# Altium schematic sheet FPGA3.SchDoc: Animated Archer Main PCB
size Letter; Author: John Eric Martin; Engineer: John Eric Martin; Organization: UCCS IEEE Robotics; Address1: 1420 Austin Bluffs Pkwy; Address2: Colorado Springs, CO 80918; DocumentNumber: FPGA3; Revision: 1; SheetNumber: 5; SheetTotal: 10; ProjectName: Animated Archer Quadcopter
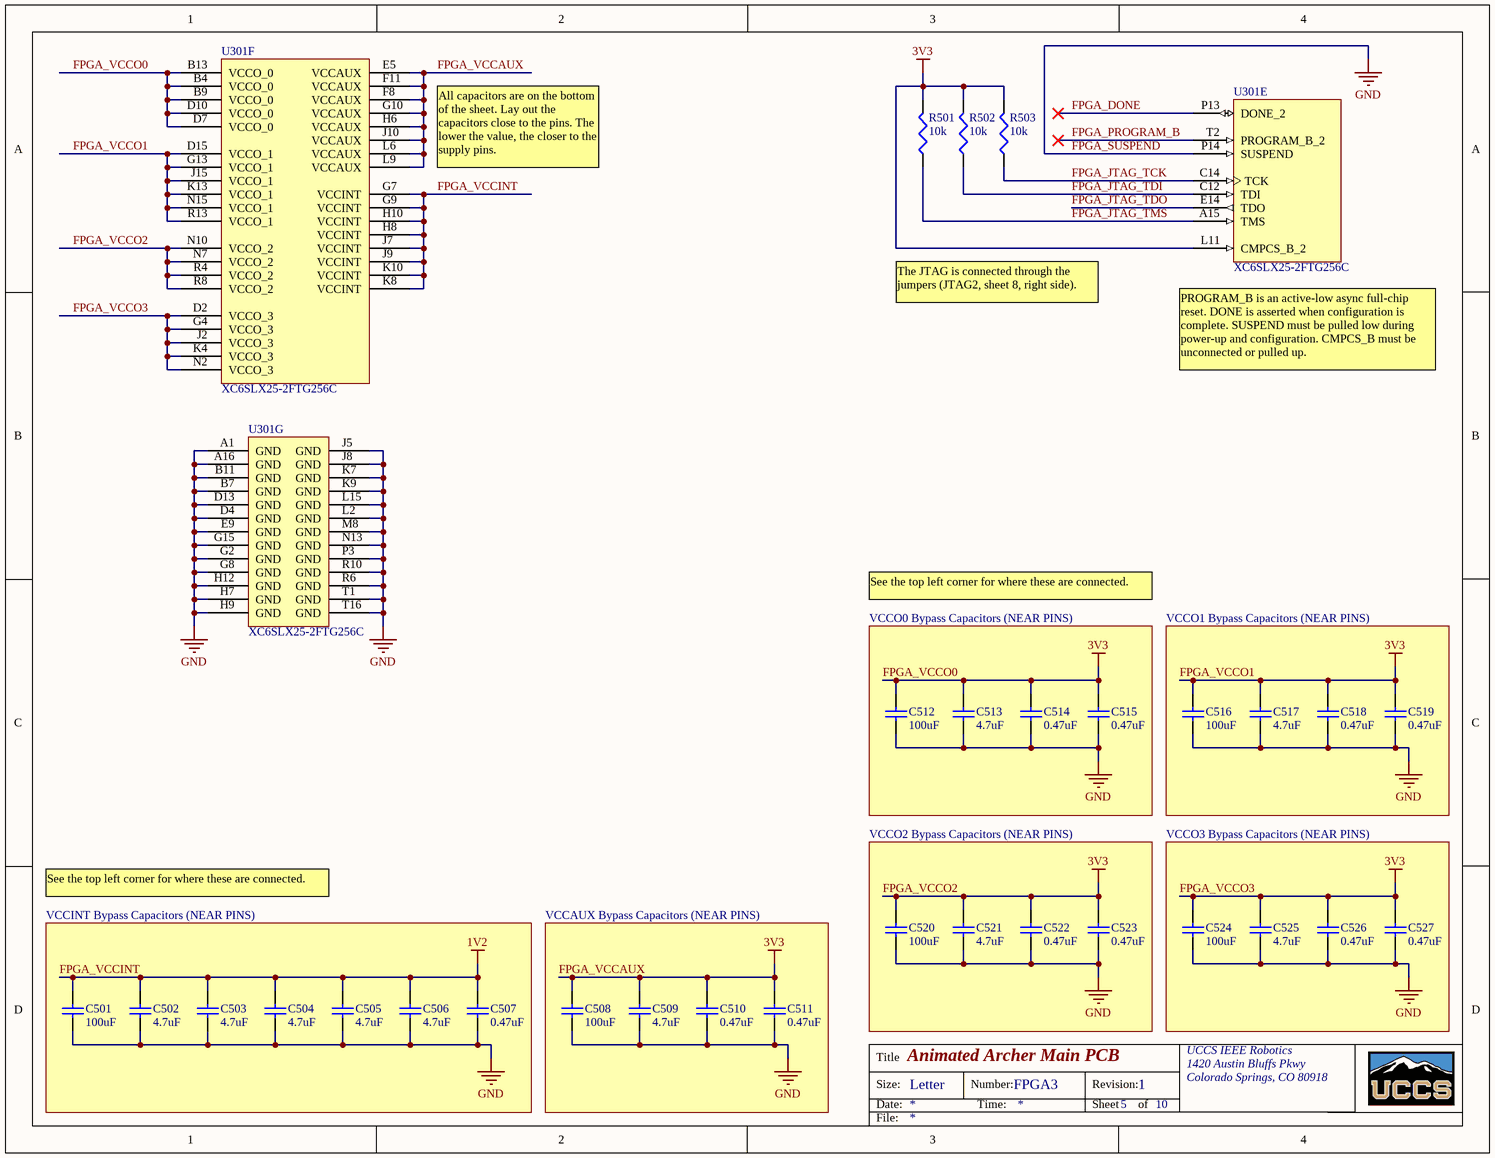
[diagram p0: FPGA3.SchDoc]

## Parts
C501  value 100uF  [1608[0603]]  (hidden comment: 0.1uF)
C502  value 4.7uF  [1608[0603]]  (hidden comment: 0.1uF)
C503  value 4.7uF  [1608[0603]]  (hidden comment: 0.1uF)
C504  value 4.7uF  [1608[0603]]  (hidden comment: 0.1uF)
C505  value 4.7uF  [1608[0603]]  (hidden comment: 0.1uF)
C506  value 4.7uF  [1608[0603]]  (hidden comment: 0.1uF)
C507  value 0.47uF  [1608[0603]]  (hidden comment: 0.1uF)
C508  value 100uF  [1608[0603]]  (hidden comment: 0.1uF)
C509  value 4.7uF  [1608[0603]]  (hidden comment: 0.1uF)
C510  value 0.47uF  [1608[0603]]  (hidden comment: 0.1uF)
C511  value 0.47uF  [1608[0603]]  (hidden comment: 0.1uF)
C512  value 100uF  [1608[0603]]  (hidden comment: 0.1uF)
C513  value 4.7uF  [1608[0603]]  (hidden comment: 0.1uF)
C514  value 0.47uF  [1608[0603]]  (hidden comment: 0.1uF)
C515  value 0.47uF  [1608[0603]]  (hidden comment: 0.1uF)
C516  value 100uF  [1608[0603]]  (hidden comment: 0.1uF)
C517  value 4.7uF  [1608[0603]]  (hidden comment: 0.1uF)
C518  value 0.47uF  [1608[0603]]  (hidden comment: 0.1uF)
C519  value 0.47uF  [1608[0603]]  (hidden comment: 0.1uF)
C520  value 100uF  [1608[0603]]  (hidden comment: 0.1uF)
C521  value 4.7uF  [1608[0603]]  (hidden comment: 0.1uF)
C522  value 0.47uF  [1608[0603]]  (hidden comment: 0.1uF)
C523  value 0.47uF  [1608[0603]]  (hidden comment: 0.1uF)
C524  value 100uF  [1608[0603]]  (hidden comment: 0.1uF)
C525  value 4.7uF  [1608[0603]]  (hidden comment: 0.1uF)
C526  value 0.47uF  [1608[0603]]  (hidden comment: 0.1uF)
C527  value 0.47uF  [1608[0603]]  (hidden comment: 0.1uF)
R501  value 10k  [J1-0603]  (hidden comment: Res3)
R502  value 10k  [J1-0603]  (hidden comment: Res3)
R503  value 10k  [J1-0603]  (hidden comment: Res3)
U301  XC6SLX25-2FTG256C  [FTG256]  (parts E,F,G of 7)

## Blocks framed on the sheet
VCCO0 Bypass Capacitors (NEAR PINS): C512-C515
VCCO1 Bypass Capacitors (NEAR PINS): C516-C519
VCCO2 Bypass Capacitors (NEAR PINS): C520-C523
VCCO3 Bypass Capacitors (NEAR PINS): C524-C527
VCCINT Bypass Capacitors (NEAR PINS): C501-C507
VCCAUX Bypass Capacitors (NEAR PINS): C508-C511

## Nets
FPGA_SUSPEND: C501.1 C502.1 C503.1 C504.1 C505.1 C506.1 C507.1 C508.1 C509.1 C510.1 C511.1 C512.1 C513.1 C514.1 C515.1 C516.1 C517.1 C518.1 C519.1 C520.1 C521.1 C522.1 C523.1 C524.1 C525.1 C526.1 C527.1 U301.A1(GND) U301.A16(GND) U301.B7(GND) U301.B11(GND) U301.D4(GND) U301.D13(GND) U301.E9(GND) U301.G2(GND) U301.G8(GND) U301.G15(GND) U301.H7(GND) U301.H9(GND) U301.H12(GND) U301.J5(GND) U301.J8(GND) U301.K7(GND) U301.K9(GND) U301.L2(GND) U301.L15(GND) U301.M8(GND) U301.N13(GND) U301.P3(GND) U301.P14(SUSPEND) U301.R6(GND) U301.R10(GND) U301.T1(GND) U301.T16(GND)  [also labelled GND]
FPGA_VCCAUX: C508.2 C509.2 C510.2 C511.2 C512.2 C513.2 C514.2 C515.2 C516.2 C517.2 C518.2 C519.2 C520.2 C521.2 C522.2 C523.2 C524.2 C525.2 C526.2 C527.2 R501.2 R502.2 R503.2 U301.B4(VCCO_0) U301.B9(VCCO_0) U301.B13(VCCO_0) U301.D2(VCCO_3) U301.D7(VCCO_0) U301.D10(VCCO_0) U301.D15(VCCO_1) U301.E5(VCCAUX) U301.F8(VCCAUX) U301.F11(VCCAUX) U301.G4(VCCO_3) U301.G10(VCCAUX) U301.G13(VCCO_1) U301.H6(VCCAUX) U301.J2(VCCO_3) U301.J10(VCCAUX) U301.J15(VCCO_1) U301.K4(VCCO_3) U301.K13(VCCO_1) U301.L6(VCCAUX) U301.L9(VCCAUX) U301.L11(CMPCS_B_2) U301.N2(VCCO_3) U301.N7(VCCO_2) U301.N10(VCCO_2) U301.N15(VCCO_1) U301.R4(VCCO_2) U301.R8(VCCO_2) U301.R13(VCCO_1)  [also labelled 3V3, FPGA_VCCO0, FPGA_VCCO1, FPGA_VCCO2, FPGA_VCCO3]
FPGA_VCCINT: C501.2 C502.2 C503.2 C504.2 C505.2 C506.2 C507.2 U301.G7(VCCINT) U301.G9(VCCINT) U301.H8(VCCINT) U301.H10(VCCINT) U301.J7(VCCINT) U301.J9(VCCINT) U301.K8(VCCINT) U301.K10(VCCINT)  [also labelled 1V2]
FPGA_DONE: U301.P13(DONE_2)
FPGA_JTAG_TCK: R503.1 U301.C14(TCK)
FPGA_JTAG_TDI: R502.1 U301.C12(TDI)
FPGA_JTAG_TDO: U301.E14(TDO)
FPGA_JTAG_TMS: R501.1 U301.A15(TMS)
FPGA_PROGRAM_B: U301.T2(PROGRAM_B_2)

## Notes on the sheet
- All capacitors are on the bottom of the sheet. Lay out the capacitors close to the pins. The lower the value, the closer to the supply pins.
- The JTAG is connected through the jumpers (JTAG2, sheet 8, right side).
- (near U301) PROGRAM_B is an active-low async full-chip reset. DONE is asserted when configuration is complete. SUSPEND must be pulled low during power-up and configuration. CMPCS_B must be unconnected or pulled up.
- See the top left corner for where these are connected.
- Title
- Size:
- Date:
- Letter
- Number:
- Time:
- Revision:
- Sheet
- of
- File:

## Library data of the parts
C501-C527 = Cap Semi: Capacitor (Semiconductor SIM Model); Published: 8-Jun-2000; LatestRevisionDate: 29-May-2009; LatestRevisionNote: IPC-7351 Footprint Added.; PackageReference: C1206; Publisher: Altium Limited; PackageDescription: Chip Capacitor
R501-R503 = Res3: Resistor; Published: 8-Jun-2000; LatestRevisionDate: 29-May-2009; LatestRevisionNote: IPC-7351 Footprint Added.; PackageReference: J1-0603; Publisher: Altium Limited; PackageDescription: Chip Resistor
U301 = XC6SLX25-2FTG256C: Spartan-6 LX 1.2V FPGA, 186 User I/Os, 256-Ball Fine-Pitch Thin BGA (1.0mm Pitch), Speed Grade 2, Commercial Grade, Pb-Free; Published: 17-Nov-2009; DatasheetVersion: ver1.6, Nov-2010; PackageVersion: ver1.3, Oct-2007; PackageReference: FTG256; Publisher: Altium Limited; PackageDescription: 256-Ball Fine Pitch Thin Ball Grid Array 1.00 mm Pitch (FTG256) - Pb-Free; Supplier 1: Digi-Key; Supplier Part Number 1: XC6SLX25-2FTG256C-ND; Code_JEDEC: MS-034-AAF-1*; ComponentLink1Description: Manufacturer Link; ComponentLink1URL: http://www.xilinx.com; ComponentLink2Description: Spartan-6 Datasheet; ComponentLink2URL: http://www.xilinx.com/support/documentation/data_sheets/ds160.pdf; ComponentLink3Description: Spartan-6 Documents; ComponentLink3URL: http://www.xilinx.com/support/documentation/spartan-6.htm; ComponentLink4Description: Xilinx.com Home; ComponentLink4URL: http://www.xilinx.com